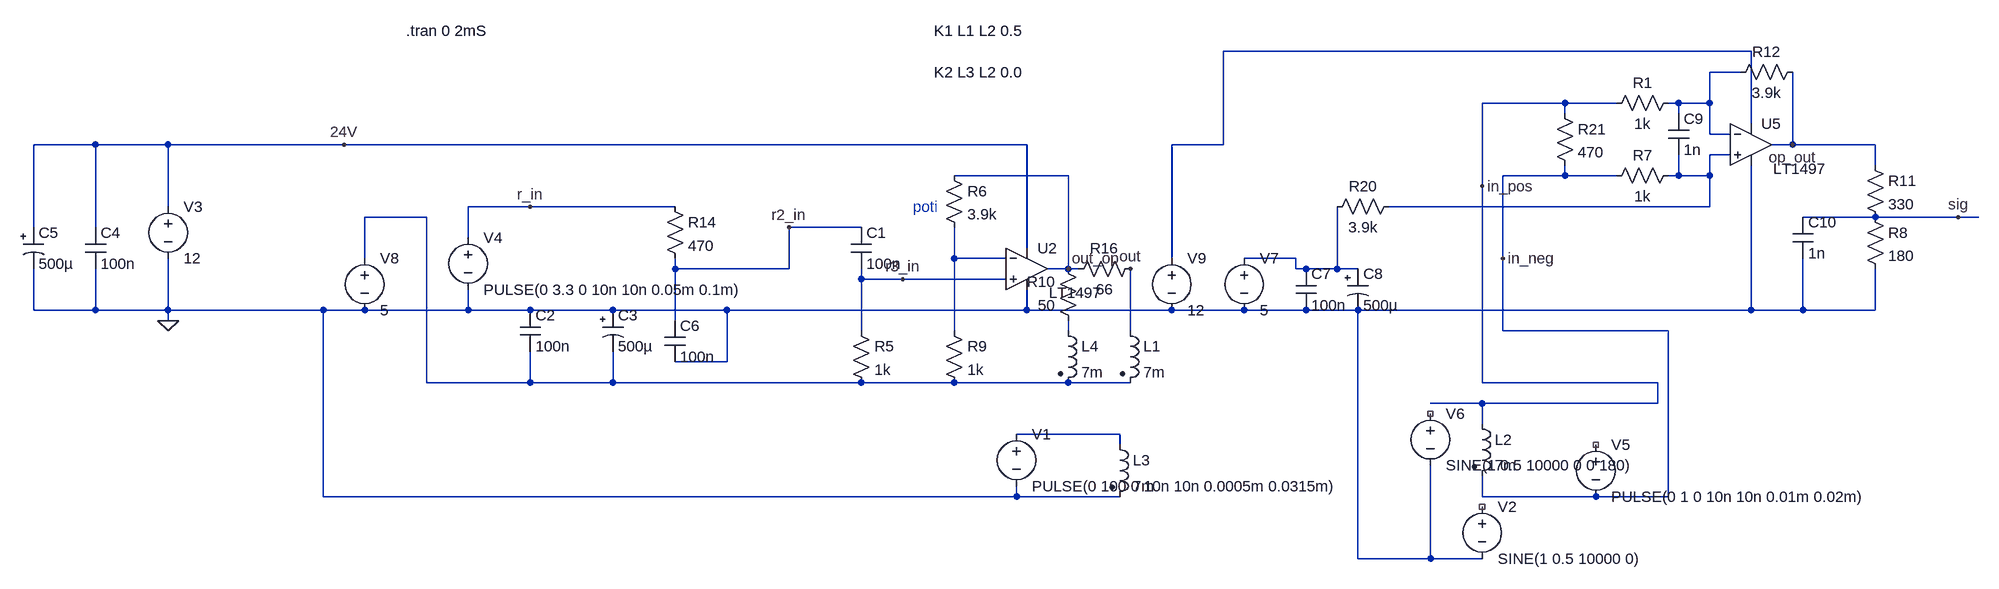
[diagram p0: schematic res2.5.asc]
res2.5.asc, the LTspice schematic file:
Version 4
SHEET 1 5176 960
WIRE 3744 -16 2928 -16
WIRE 3728 16 3680 16
WIRE 3456 64 3328 64
WIRE 3536 64 3456 64
WIRE 3632 64 3616 64
WIRE 3680 64 3680 16
WIRE 3680 64 3632 64
WIRE 3456 80 3456 64
WIRE 3632 80 3632 64
WIRE 3744 96 3744 -16
WIRE 3680 112 3680 64
WIRE 3712 112 3680 112
WIRE 1184 128 1088 128
WIRE 1296 128 1184 128
WIRE 1568 128 1296 128
WIRE 2624 128 1568 128
WIRE 2928 128 2928 -16
WIRE 2928 128 2848 128
WIRE 3808 128 3808 16
WIRE 3808 128 3776 128
WIRE 3936 128 3808 128
WIRE 3712 144 3680 144
WIRE 3936 160 3936 128
WIRE 2688 176 2512 176
WIRE 3456 176 3456 160
WIRE 3456 176 3360 176
WIRE 3536 176 3456 176
WIRE 3632 176 3632 144
WIRE 3632 176 3616 176
WIRE 3680 176 3680 144
WIRE 3680 176 3632 176
WIRE 3328 192 3328 64
WIRE 1296 224 1296 128
WIRE 1856 224 1760 224
WIRE 2080 224 1856 224
WIRE 3680 224 3680 176
WIRE 3680 224 3184 224
WIRE 1696 240 1600 240
WIRE 3936 240 3824 240
WIRE 4064 240 3936 240
WIRE 4096 240 4064 240
WIRE 1088 256 1088 128
WIRE 1184 256 1184 128
WIRE 2368 256 2256 256
WIRE 1760 272 1760 224
WIRE 2624 288 2624 128
WIRE 1600 304 1600 240
WIRE 2512 304 2512 256
WIRE 2592 304 2512 304
WIRE 2848 304 2848 128
WIRE 3040 304 2960 304
WIRE 3360 304 3360 176
WIRE 2080 320 2080 304
WIRE 2256 320 2256 256
WIRE 2256 320 2080 320
WIRE 2688 320 2688 176
WIRE 2688 320 2656 320
WIRE 2704 320 2688 320
WIRE 3040 320 3040 304
WIRE 3056 320 3040 320
WIRE 3104 320 3104 224
WIRE 3104 320 3056 320
WIRE 3136 320 3104 320
WIRE 2368 336 2368 320
WIRE 2432 336 2368 336
WIRE 2592 336 2432 336
WIRE 1088 384 1088 320
WIRE 1184 384 1184 320
WIRE 1184 384 1088 384
WIRE 1296 384 1296 304
WIRE 1296 384 1184 384
WIRE 1536 384 1296 384
WIRE 1600 384 1536 384
WIRE 1760 384 1760 352
WIRE 1760 384 1600 384
WIRE 1856 384 1760 384
WIRE 1984 384 1856 384
WIRE 2160 384 1984 384
WIRE 2624 384 2624 352
WIRE 2624 384 2160 384
WIRE 2848 384 2624 384
WIRE 2960 384 2848 384
WIRE 3056 384 2960 384
WIRE 3136 384 3056 384
WIRE 3744 384 3744 160
WIRE 3744 384 3136 384
WIRE 3824 384 3824 304
WIRE 3824 384 3744 384
WIRE 3936 384 3936 320
WIRE 3936 384 3824 384
WIRE 1296 400 1296 384
WIRE 2080 400 2080 320
WIRE 2368 416 2368 336
WIRE 2512 416 2512 304
WIRE 2688 416 2688 400
WIRE 2784 416 2784 320
WIRE 3360 416 3360 304
WIRE 3616 416 3360 416
WIRE 2160 464 2160 384
WIRE 2160 464 2080 464
WIRE 1696 496 1696 240
WIRE 1856 496 1856 448
WIRE 1856 496 1696 496
WIRE 1984 496 1984 448
WIRE 1984 496 1856 496
WIRE 2368 496 1984 496
WIRE 2512 496 2368 496
WIRE 2688 496 2512 496
WIRE 2784 496 2688 496
WIRE 3328 496 3328 192
WIRE 3600 496 3328 496
WIRE 3328 528 3248 528
WIRE 3600 528 3600 496
WIRE 3600 528 3328 528
WIRE 3328 560 3328 528
WIRE 2768 576 2608 576
WIRE 2768 592 2768 576
WIRE 1536 672 1536 384
WIRE 2608 672 2608 656
WIRE 2608 672 1536 672
WIRE 2768 672 2608 672
WIRE 3328 672 3328 640
WIRE 3504 672 3328 672
WIRE 3616 672 3616 416
WIRE 3616 672 3504 672
WIRE 3136 768 3136 384
WIRE 3248 768 3248 624
WIRE 3248 768 3136 768
WIRE 3328 768 3248 768
FLAG 1296 400 0
FLAG 1856 224 r_in
FLAG 2256 256 r2_in
FLAG 2432 336 r3_in
FLAG 1568 128 24V
FLAG 4064 240 sig
FLAG 3808 128 op_out
FLAG 2784 320 out
FLAG 2688 320 out_op
FLAG 3328 192 in_pos
FLAG 3360 304 in_neg
SYMBOL voltage 1296 208 R0
SYMATTR InstName V3
SYMATTR Value 12
SYMATTR SpiceLine Rser=1
SYMBOL ind2 2768 400 R0
SYMATTR InstName L1
SYMATTR Value 7m
SYMATTR Type ind
SYMATTR SpiceLine Rser=30
SYMBOL Opamps/LT1497 2624 256 R0
WINDOW 3 34 101 Left 2
SYMATTR InstName U2
SYMBOL ind2 3312 544 R0
SYMATTR InstName L2
SYMATTR Value 7m
SYMATTR SpiceLine Rser=70
SYMBOL res 2352 400 R0
SYMATTR InstName R5
SYMATTR Value 1k
SYMBOL cap 2352 256 R0
SYMATTR InstName C1
SYMATTR Value 100n
SYMBOL res 2496 160 R0
SYMATTR InstName R6
SYMATTR Value 3.9k
SYMBOL res 2496 400 R0
SYMATTR InstName R9
SYMATTR Value 1k
SYMBOL voltage 1760 256 R0
SYMATTR InstName V4
SYMATTR Value PULSE(0 3.3 0 10n 10n 0.05m 0.1m)
SYMATTR SpiceLine Rser=1
SYMBOL cap 2064 400 R0
SYMATTR InstName C6
SYMATTR Value 100n
SYMBOL res 2064 208 R0
SYMATTR InstName R14
SYMATTR Value 470
SYMBOL cap 1840 384 R0
SYMATTR InstName C2
SYMATTR Value 100n
SYMBOL polcap 1968 384 R0
SYMATTR InstName C3
SYMATTR Value 500µ
SYMBOL cap 1168 256 R0
SYMATTR InstName C4
SYMATTR Value 100n
SYMBOL polcap 1072 256 R0
SYMATTR InstName C5
SYMATTR Value 500µ
SYMBOL ind2 2752 576 R0
SYMATTR InstName L3
SYMATTR Value 7m
SYMATTR Type ind
SYMATTR SpiceLine Rser=30
SYMBOL voltage 2608 560 R0
SYMATTR InstName V1
SYMATTR Value PULSE(0 100 0 10n 10n 0.0005m 0.0315m)
SYMATTR SpiceLine Rser=1
SYMBOL Opamps/LT1497 3744 64 R0
WINDOW 3 34 101 Left 2
SYMATTR InstName U5
SYMBOL res 3824 0 R90
WINDOW 0 0 56 VBottom 2
WINDOW 3 32 56 VTop 2
SYMATTR InstName R12
SYMATTR Value 3.9k
SYMBOL cap 3040 320 R0
SYMATTR InstName C7
SYMATTR Value 100n
SYMBOL polcap 3120 320 R0
SYMATTR InstName C8
SYMATTR Value 500µ
SYMBOL res 3920 224 R0
SYMATTR InstName R8
SYMATTR Value 180
SYMBOL res 3920 144 R0
SYMATTR InstName R11
SYMATTR Value 330
SYMBOL cap 3808 240 R0
SYMATTR InstName C10
SYMATTR Value 1n
SYMBOL voltage 3328 672 R0
SYMATTR InstName V2
SYMATTR Value SINE(1 0.5 10000 0)
SYMATTR SpiceLine Rser=1
SYMBOL res 2800 304 R90
WINDOW 0 0 56 VBottom 2
WINDOW 3 32 56 VTop 2
SYMATTR InstName R16
SYMATTR Value 66
SYMBOL voltage 3248 528 R0
SYMATTR InstName V6
SYMATTR Value SINE(1 0.5 10000 0 0 180)
SYMATTR SpiceLine Rser=1
SYMBOL res 3440 64 R0
SYMATTR InstName R21
SYMATTR Value 470
SYMBOL res 3632 48 R90
WINDOW 0 0 56 VBottom 2
WINDOW 3 32 56 VTop 2
SYMATTR InstName R1
SYMATTR Value 1k
SYMBOL res 3632 160 R90
WINDOW 0 0 56 VBottom 2
WINDOW 3 32 56 VTop 2
SYMATTR InstName R7
SYMATTR Value 1k
SYMBOL res 3200 208 R90
WINDOW 0 0 56 VBottom 2
WINDOW 3 32 56 VTop 2
SYMATTR InstName R20
SYMATTR Value 3.9k
SYMBOL cap 3616 80 R0
SYMATTR InstName C9
SYMATTR Value 1n
SYMBOL voltage 3504 576 R0
SYMATTR InstName V5
SYMATTR Value PULSE(0 1 0 10n 10n 0.01m 0.02m)
SYMATTR SpiceLine Rser=1
SYMBOL ind2 2672 400 R0
SYMATTR InstName L4
SYMATTR Value 7m
SYMATTR Type ind
SYMATTR SpiceLine Rser=30
SYMBOL res 2704 416 R180
WINDOW 0 36 76 Left 2
WINDOW 3 36 40 Left 2
SYMATTR InstName R10
SYMATTR Value 50
SYMBOL voltage 2960 288 R0
SYMATTR InstName V7
SYMATTR Value 5
SYMATTR SpiceLine Rser=1
SYMBOL voltage 1600 288 R0
SYMATTR InstName V8
SYMATTR Value 5
SYMATTR SpiceLine Rser=1
SYMBOL voltage 2848 288 R0
SYMATTR InstName V9
SYMATTR Value 12
SYMATTR SpiceLine Rser=1
TEXT 1664 -48 Left 2 !.tran 0 2mS
TEXT 2480 -48 Left 2 !K1 L1 L2 0.5
TEXT 2480 16 Left 2 !K2 L3 L2 0.0
TEXT 2448 224 Left 2 ;poti

The netlist it stands for:
* res2.5.asc
V3 24V 0 12 Rser=1
L1 out N004 7m Rser=30
XU2 r3_in N005 24V 0 out_op LT1497  ; pins In+ In- V+ V- OUT
L2 in_pos in_neg 7m Rser=70
R5 r3_in N004 1k
C1 r2_in r3_in 100n
R6 out_op N005 3.9k
R9 N005 N004 1k
V4 r_in 0 PULSE(0 3.3 0 10n 10n 0.05m 0.1m) Rser=1
C6 r2_in 0 100n
R14 r_in r2_in 470
C2 0 N004 100n
C3 0 N004 500µ
C4 24V 0 100n
C5 24V 0 500µ
L3 N008 0 7m Rser=30
V1 N008 0 PULSE(0 100 0 10n 10n 0.0005m 0.0315m) Rser=1
XU5 N003 N002 N001 0 op_out LT1497  ; pins In+ In- V+ V- OUT
R12 op_out N002 3.9k
C7 N006 0 100n
C8 N006 0 500µ
R8 sig 0 180
R11 op_out sig 330
C10 sig 0 1n
V2 NC_01 0 SINE(1 0.5 10000 0) Rser=1
R16 out out_op 66
V6 NC_02 0 SINE(1 0.5 10000 0 0 180) Rser=1
R21 in_pos in_neg 470
R1 N002 in_pos 1k
R7 N003 in_neg 1k
R20 N003 N006 3.9k
C9 N002 N003 1n
V5 NC_03 in_neg PULSE(0 1 0 10n 10n 0.01m 0.02m) Rser=1
L4 N007 N004 7m Rser=30
R10 N007 out_op 50
V7 N006 0 5 Rser=1
V8 N004 0 5 Rser=1
V9 N001 0 12 Rser=1
.tran 0 2mS
K1 L1 L2 0.5
K2 L3 L2 0.0
* poti
.backanno
.end